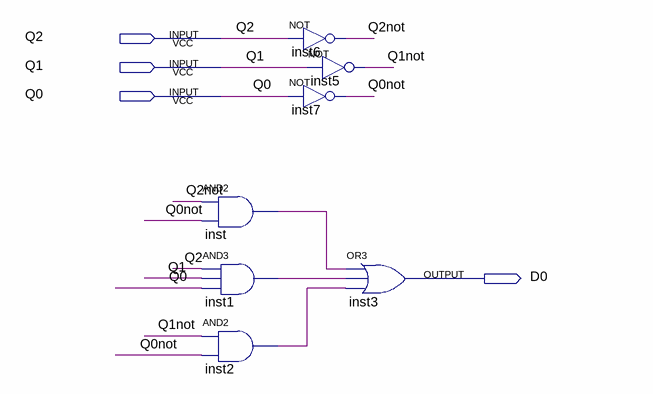
[diagram p0: schematic sheet]
// Quartus schematic D0.bdf as structural Verilog: 7 symbols, 4 pins
module D0 (
  input  Q2,
  input  Q1,
  input  Q0,
  output D0
);

  wire inst1_out, inst2_out, inst_out, Q0not, Q1not, Q2not;

  and inst (inst_out, Q2not, Q0not);
  and inst1 (inst1_out, Q2, Q1, Q0);
  and inst2 (inst2_out, Q1not, Q0not);
  not inst6 (Q2not, Q2);
  not inst5 (Q1not, Q1);
  not inst7 (Q0not, Q0);
  or inst3 (D0, inst_out, inst1_out, inst2_out);
endmodule
